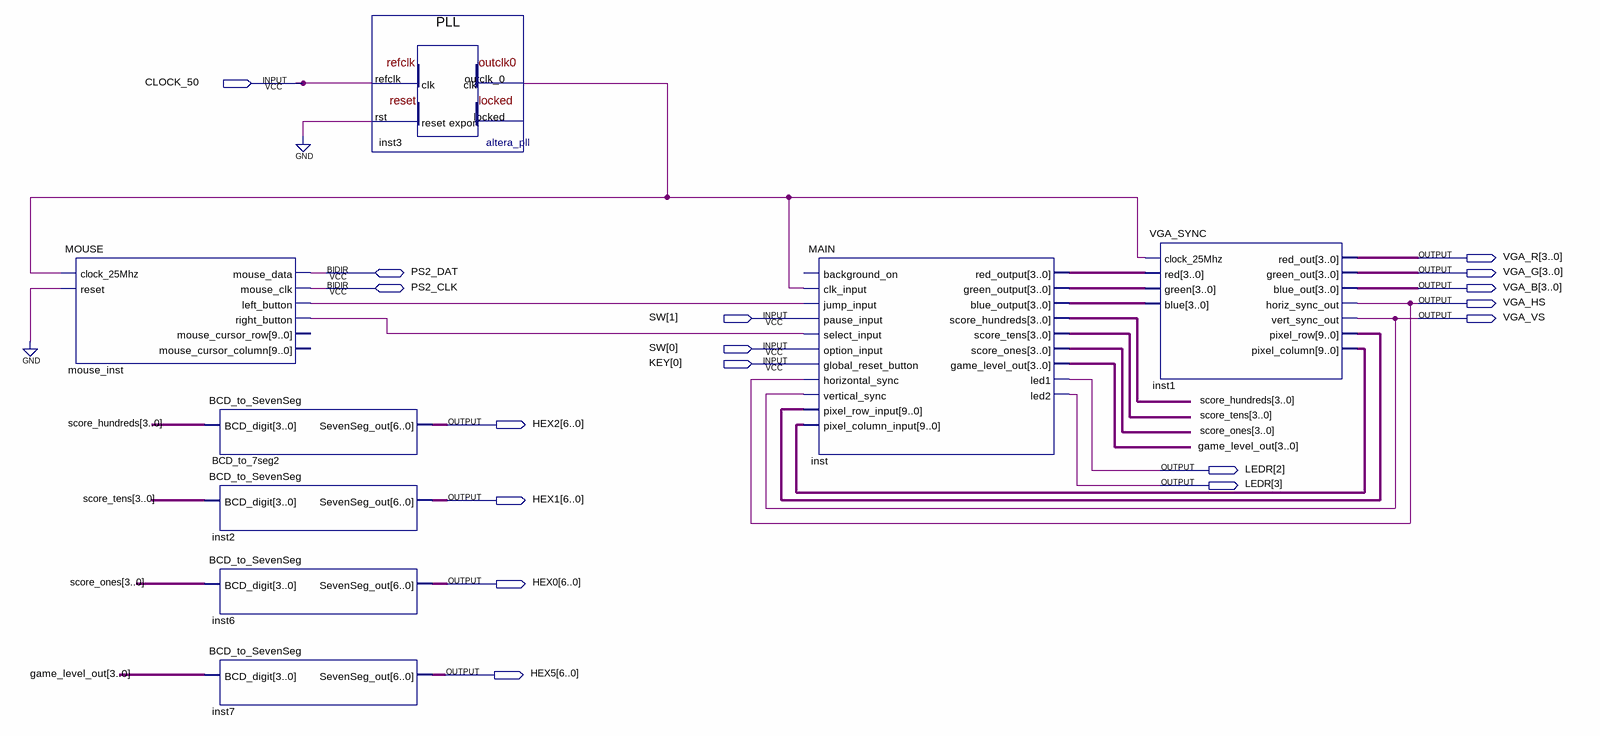
[diagram p0: schematic sheet]
// Quartus schematic Bird_Block.bdf as structural Verilog: 8 symbols, 17 pins
module Bird_Block (
  input  CLOCK_50,
  input  [1:0] SW,
  input  [0:0] KEY,
  inout  PS2_DAT,
  inout  PS2_CLK,
  output [3:0] VGA_R,
  output [3:0] VGA_G,
  output [3:0] VGA_B,
  output VGA_HS,
  output VGA_VS,
  output [6:0] HEX2,
  output [3:2] LEDR,
  output [6:0] HEX1,
  output [6:0] HEX0,
  output [6:0] HEX5
);

  wire inst3_outclk_0, mouse_inst_left_button, mouse_inst_right_button;
  wire [3:0] game_level_out, inst_blue_output, inst_green_output, inst_red_output, score_hundreds,
       score_ones, score_tens;
  wire [9:0] inst1_pixel_column, inst1_pixel_row;

  MOUSE mouse_inst (
    .clock_25Mhz(inst3_outclk_0), .reset(1'b0), .left_button(mouse_inst_left_button),
    .right_button(mouse_inst_right_button), .mouse_data(PS2_DAT), .mouse_clk(PS2_CLK));  // open: mouse_cursor_row, mouse_cursor_column
  BCD_to_SevenSeg BCD_to_7seg2 (.BCD_digit(score_hundreds), .SevenSeg_out(HEX2));
  BCD_to_SevenSeg inst2 (.BCD_digit(score_tens), .SevenSeg_out(HEX1));
  BCD_to_SevenSeg inst6 (.BCD_digit(score_ones), .SevenSeg_out(HEX0));
  BCD_to_SevenSeg inst7 (.BCD_digit(game_level_out), .SevenSeg_out(HEX5));
  PLL inst3 (.refclk(CLOCK_50), .rst(1'b0), .outclk_0(inst3_outclk_0));  // open: locked
  MAIN inst (
    .clk_input(inst3_outclk_0), .jump_input(mouse_inst_left_button), .pause_input(SW[1]),
    .select_input(mouse_inst_right_button), .option_input(SW[0]), .global_reset_button(KEY[0]),
    .horizontal_sync(VGA_HS), .vertical_sync(VGA_VS), .pixel_row_input(inst1_pixel_row),
    .pixel_column_input(inst1_pixel_column), .red_output(inst_red_output), .green_output(inst_green_output),
    .blue_output(inst_blue_output), .score_hundreds(score_hundreds), .score_tens(score_tens),
    .score_ones(score_ones), .game_level_out(game_level_out), .led1(LEDR[2]), .led2(LEDR[3]));  // open: background_on
  VGA_SYNC inst1 (
    .clock_25Mhz(inst3_outclk_0), .red(inst_red_output), .green(inst_green_output), .blue(inst_blue_output),
    .red_out(VGA_R), .green_out(VGA_G), .blue_out(VGA_B), .horiz_sync_out(VGA_HS), .vert_sync_out(VGA_VS),
    .pixel_row(inst1_pixel_row), .pixel_column(inst1_pixel_column));
endmodule
